# Altium schematic sheet xlrconn.SCHDOC
size Letter
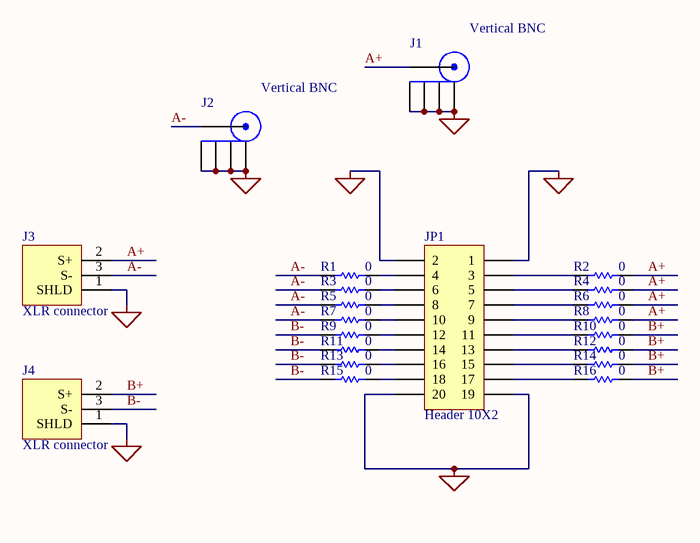
[diagram p0: xlrconn.SCHDOC]

## Parts
J1  Vertical BNC  [Vertical BNC 227699-1]
J2  Vertical BNC  [Vertical BNC 227699-1]
J3  XLR connector  [NC3FAH-0]
J4  XLR connector  [NC3FAH-0]
JP1  Header 10X2  [HDR2X10]
R1  0  [CR1005-0402]
R2  0  [CR1005-0402]
R3  0  [CR1005-0402]
R4  0  [CR1005-0402]
R5  0  [CR1005-0402]
R6  0  [CR1005-0402]
R7  0  [CR1005-0402]
R8  0  [CR1005-0402]
R9  0  [CR1005-0402]
R10  0  [CR1005-0402]
R11  0  [CR1005-0402]
R12  0  [CR1005-0402]
R13  0  [CR1005-0402]
R14  0  [CR1005-0402]
R15  0  [CR1005-0402]
R16  0  [CR1005-0402]

## Nets
GND: J1.2(SHLD) J1.3(SHLD) J1.4(SHLD) J1.5(SHLD) J2.2(SHLD) J2.3(SHLD) J2.4(SHLD) J2.5(SHLD) J3.1(SHLD) J4.1(SHLD) JP1.1 JP1.2 JP1.19 JP1.20
A+: J1.1(PIN) J3.2(S+) R2.2 R4.2 R6.2 R8.2
A-: J2.1(PIN) J3.3(S-) R1.1 R3.1 R5.1 R7.1
B+: J4.2(S+) R10.2 R12.2 R14.2 R16.2
B-: J4.3(S-) R9.1 R11.1 R13.1 R15.1
NetJP1_3: JP1.3 R2.1
NetJP1_4: JP1.4 R1.2
NetJP1_5: JP1.5 R4.1
NetJP1_6: JP1.6 R3.2
NetJP1_7: JP1.7 R6.1
NetJP1_8: JP1.8 R5.2
NetJP1_9: JP1.9 R8.1
NetJP1_10: JP1.10 R7.2
NetJP1_11: JP1.11 R10.1
NetJP1_12: JP1.12 R9.2
NetJP1_13: JP1.13 R12.1
NetJP1_14: JP1.14 R11.2
NetJP1_15: JP1.15 R14.1
NetJP1_16: JP1.16 R13.2
NetJP1_17: JP1.17 R16.1
NetJP1_18: JP1.18 R15.2

## Library data of the parts
J1 J2 = VERTBNC: Vertical BNC with correct grounding pin behavior
J3 J4 = XLR: XLR balanced connector, standard
JP1 = Header 10X2: Header, 10-Pin, Dual row; Manufacturer: Generic Components; Class I: Connector; Revision: July-2002: Re-released for DXP Platform.; Publisher: Altium Limited
R1-R16 = Res1: Resistor; Published: 8-Jun-2000; LatestRevisionDate: 17-Jul-2002; LatestRevisionNote: Re-released for DXP Platform.; Publisher: Altium Limited